# Altium schematic sheet Sheet2.SchDoc
size B
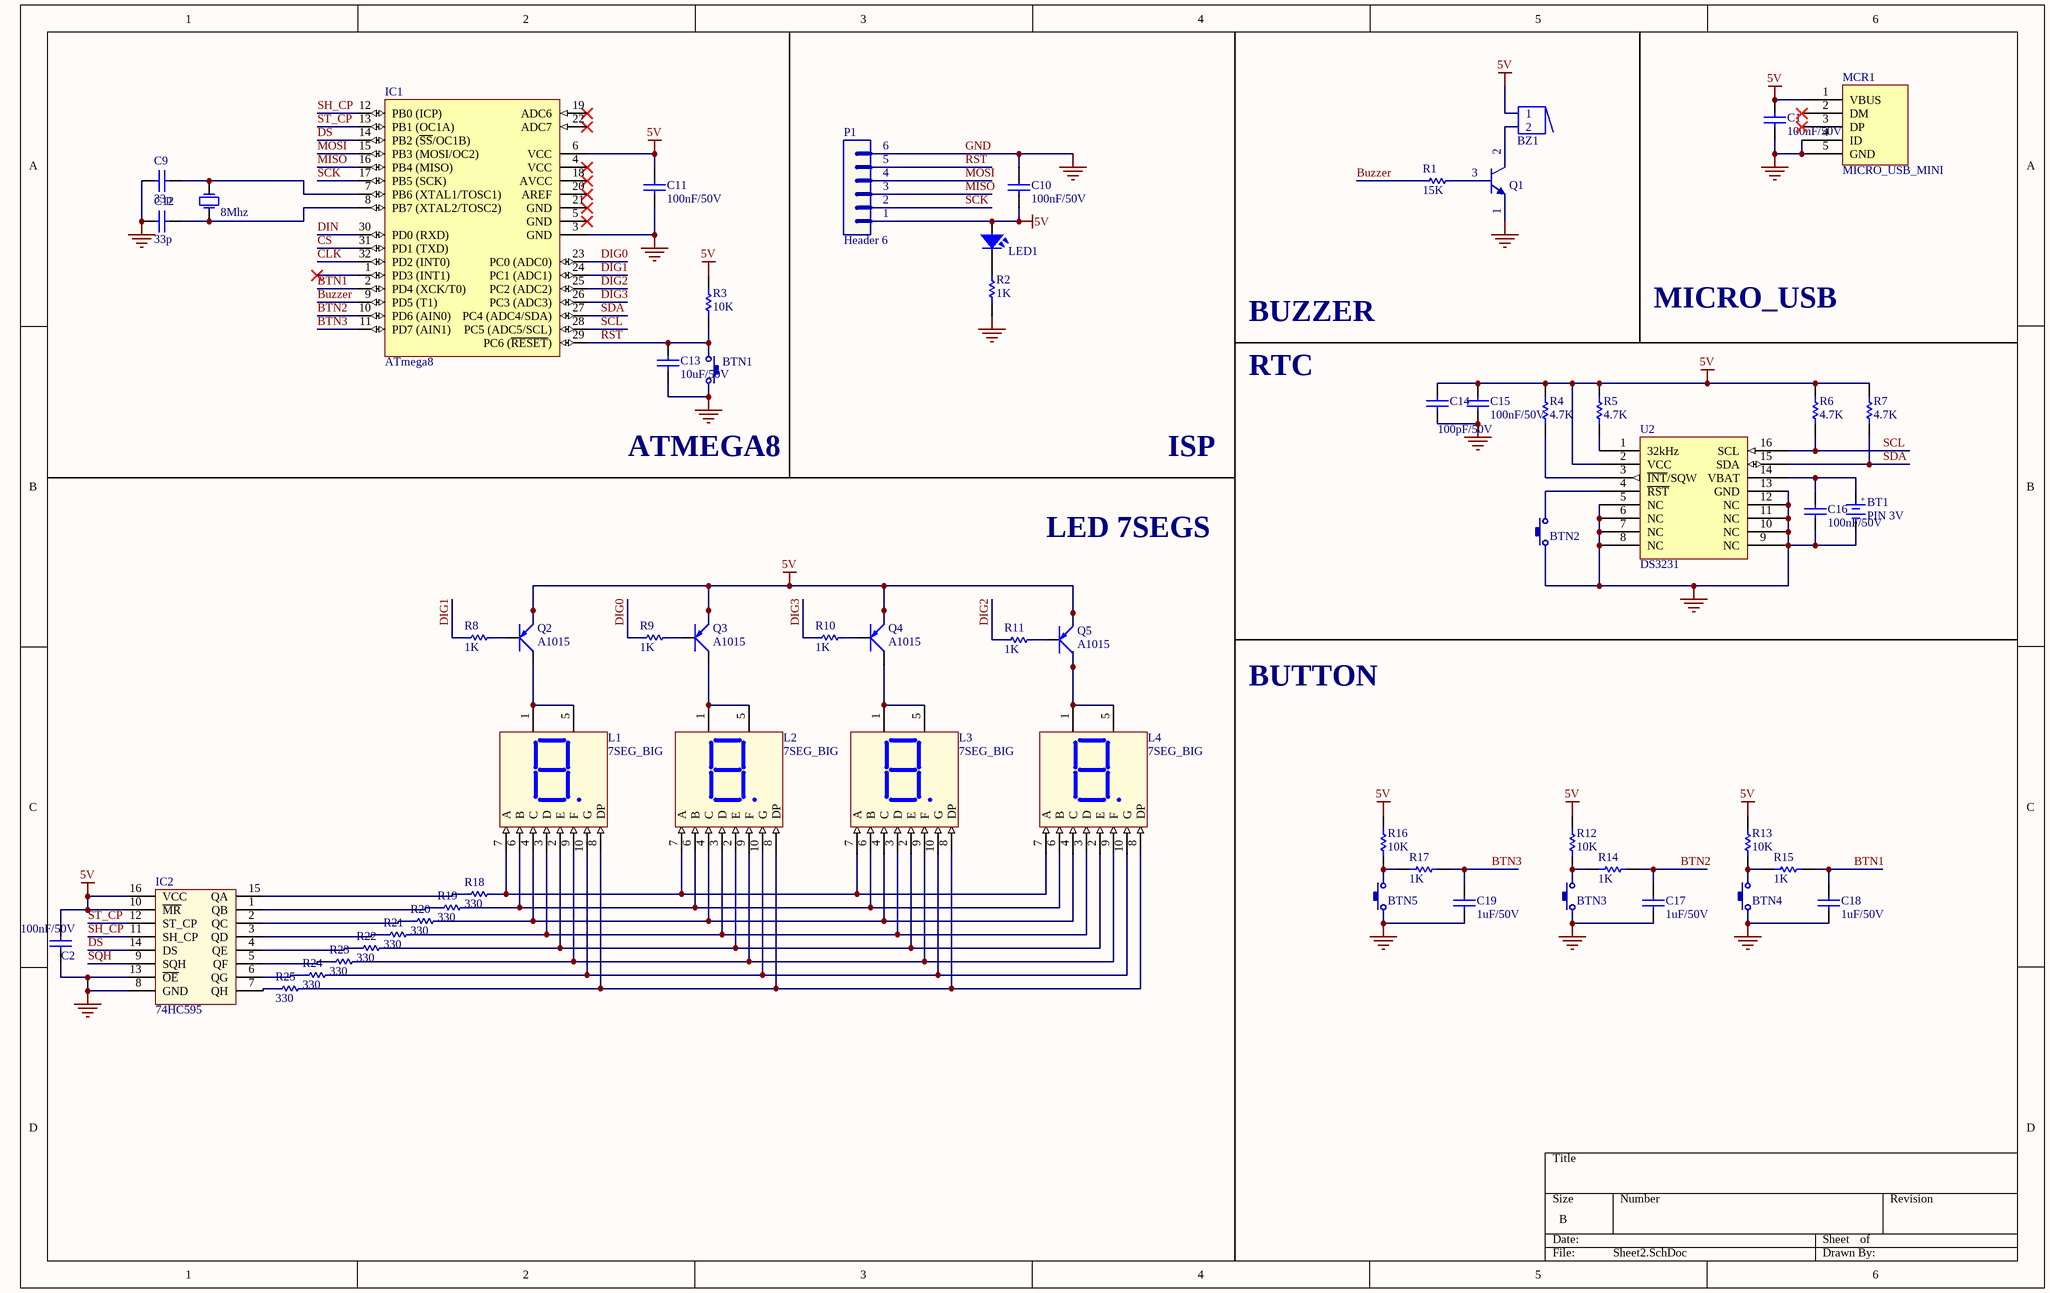
[diagram p0: Sheet2.SchDoc]

## Parts
BT1  PIN 3V  [PIN3V]
BTN1  Button  [Button]  (value not drawn)
BTN2  Button  [Button]  (value not drawn)
BTN3  Button  [Button]  (value not drawn)
BTN4  Button  [Button]  (value not drawn)
BTN5  Button  [Button]  (value not drawn)
BZ1  Buzzer  [BUZZER]  (value not drawn)
C1  value 100nF/50V  [CAP-SM-0805]  (hidden comment: Cap-100nF-50V-0805)
C2  value 100nF/50V  [CAP-SM-0805]  (hidden comment: Cap-100nF-50V-0805)
C9  value 33p  [Tu-pico]  (hidden comment: Capacitor Ceramic)
C10  value 100nF/50V  [CAP-SM-0805]  (hidden comment: Cap-100nF-50V-0805)
C11  value 100nF/50V  [CAP-SM-0805]  (hidden comment: Cap-100nF-50V-0805)
C12  value 33p  [Tu-pico]  (hidden comment: Capacitor Ceramic)
C13  value 10uF/50V  [CAP-SM-0805]  (hidden comment: Cap-10uF-50V-0805)
C14  value 100pF/50V  [CAP-SM-0805]  (hidden comment: Cap-100pF-50V-0805)
C15  value 100nF/50V  [CAP-SM-0805]  (hidden comment: Cap-10uF-50V-0805)
C16  value 100nF/50V  [CAP-SM-0805]  (hidden comment: Cap-10uF-50V-0805)
C17  value 1uF/50V  [CAP-SM-0805]  (hidden comment: Cap-10uF-50V-0805)
C18  value 1uF/50V  [CAP-SM-0805]  (hidden comment: Cap-10uF-50V-0805)
C19  value 1uF/50V  [CAP-SM-0805]  (hidden comment: Cap-10uF-50V-0805)
IC1  ATmega8  [32A_ATM]
IC2  74HC595  [DIP16/W0.3]
L1  7SEG_BIG  [7SEGS_BIG 48 x 70]
L2  7SEG_BIG  [7SEGS_BIG 48 x 70]
L3  7SEG_BIG  [7SEGS_BIG 48 x 70]
L4  7SEG_BIG  [7SEGS_BIG 48 x 70]
LED1  LED  [LED 3512]  (value not drawn)
MCR1  MICRO_USB_MINI  [USB-B-Mini]
P1  Header 6  [JP6]
Q1  Transistor C1815  [SOT23-3 Leads]  (value not drawn)
Q2  A1015  [SOT23B]
Q3  A1015  [SOT23B]
Q4  A1015  [SOT23B]
Q5  A1015  [SOT23B]
R1  value 15K  [RES-SM-0805]  (hidden comment: Resistor 1/4W)
R2  value 1K  [RES-SM-0805]  (hidden comment: Res-1K-0805)
R3  value 10K  [RES-SM-0805]  (hidden comment: Res-10k-0805)
R4  value 4.7K  [RES-SM-0805]  (hidden comment: Res-10k-0805)
R5  value 4.7K  [RES-SM-0805]  (hidden comment: Res-10k-0805)
R6  value 4.7K  [RES-SM-0805]  (hidden comment: Res-10k-0805)
R7  value 4.7K  [RES-SM-0805]  (hidden comment: Res-10k-0805)
R8  value 1K  [RES-SM-0805]  (hidden comment: Resistor 1/4W)
R9  value 1K  [RES-SM-0805]  (hidden comment: Resistor 1/4W)
R10  value 1K  [RES-SM-0805]  (hidden comment: Resistor 1/4W)
R11  value 1K  [RES-SM-0805]  (hidden comment: Resistor 1/4W)
R12  value 10K  [RES-SM-0805]  (hidden comment: Res-1K-0805)
R13  value 10K  [RES-SM-0805]  (hidden comment: Res-1K-0805)
R14  value 1K  [RES-SM-0805]  (hidden comment: Res-1K-0805)
R15  value 1K  [RES-SM-0805]  (hidden comment: Res-1K-0805)
R16  value 10K  [RES-SM-0805]  (hidden comment: Res-1K-0805)
R17  value 1K  [RES-SM-0805]  (hidden comment: Res-1K-0805)
R18  value 330  [RES-SM-0805]  (hidden comment: Resistor 1/4W)
R19  value 330  [RES-SM-0805]  (hidden comment: Resistor 1/4W)
R20  value 330  [RES-SM-0805]  (hidden comment: Resistor 1/4W)
R21  value 330  [RES-SM-0805]  (hidden comment: Resistor 1/4W)
R22  value 330  [RES-SM-0805]  (hidden comment: Resistor 1/4W)
R23  value 330  [RES-SM-0805]  (hidden comment: Resistor 1/4W)
R24  value 330  [RES-SM-0805]  (hidden comment: Resistor 1/4W)
R25  value 330  [RES-SM-0805]  (hidden comment: Resistor 1/4W)
U2  DS3231  [SL3016]
Y1  8Mhz  [XTAL]

## Nets
5V: BZ1.1 C1.2 C2.2 C10.1 C11.2 C14.2 C15.2 IC1.6(VCC) IC2.10(~{MR}) IC2.16(VCC) LED1.1 MCR1.1(VBUS) P1.1 Q2.1(E) Q3.1(E) Q4.1(E) Q5.1(E) R3.2 R4.2 R5.2 R6.2 R7.2 R12.2 R13.2 R16.2 U2.2(VCC)
GND: BT1.2(GND) BTN1.2 BTN2.1 BTN3.1 BTN4.1 BTN5.1 C1.1 C2.1 C9.1 C10.2 C11.1 C12.1 C13.1 C14.1 C15.1 C16.1 C17.2 C18.2 C19.2 IC1.3(GND) IC2.8(GND) IC2.13(~{OE}) MCR1.4(ID) MCR1.5(GND) P1.6 Q1.1(E) R2.1 U2.5(NC) U2.6(NC) U2.7(NC) U2.8(NC) U2.9(NC) U2.10(NC) U2.11(NC) U2.12(NC) U2.13(GND)
VCC: IC2.16(VCC)
BTN1: C18.1 IC1.2(PD4_(XCK/T0)) R15.2
BTN2: C17.1 IC1.10(PD6_(AIN0)) R14.2
BTN3: C19.1 IC1.11(PD7_(AIN1)) R17.2
Buzzer: IC1.9(PD5_(T1)) R1.1
CLK: IC1.32(PD2_(INT0))
CS: IC1.31(PD1_(TXD))
DIG0: IC1.23(PC0_(ADC0)) R9.1
DIG1: IC1.24(PC1_(ADC1)) R8.1
DIG2: IC1.25(PC2_(ADC2)) R11.1
DIG3: IC1.26(PC3_(ADC3)) R10.1
DIN: IC1.30(PD0_(RXD))
DS: IC1.14(PB2_(~{SS}/OC1B)) IC2.14(DS)
MISO: IC1.16(PB4_(MISO)) P1.3
MOSI: IC1.15(PB3_(MOSI/OC2)) P1.4
RST: BTN1.1 C13.2 IC1.29(PC6_(~{RESET})) P1.5 R3.1
SCK: IC1.17(PB5_(SCK)) P1.2
SCL: IC1.28(PC5_(ADC5/SCL)) R6.1 U2.16(SCL)
SDA: IC1.27(PC4_(ADC4/SDA)) R7.1 U2.15(SDA)
SH_CP: IC1.12(PB0_(ICP)) IC2.11(SH_CP)
SQH: IC2.9(SQH)
ST_CP: IC1.13(PB1_(OC1A)) IC2.12(ST_CP)
NetBT1_1: BT1.1(+3V) C16.2 U2.14(VBAT)
NetBTN2_2: BTN2.2 U2.4(~{RST})
NetBTN3_2: BTN3.2 R12.1 R14.1
NetBTN4_2: BTN4.2 R13.1 R15.1
NetBTN5_2: BTN5.2 R16.1 R17.1
NetBZ1_2: BZ1.2 Q1.2(C)
NetC9_2: C9.2 IC1.7(PB6_(XTAL1/TOSC1)) Y1.2(OSC2)
NetC12_2: C12.2 IC1.8(PB7_(XTAL2/TOSC2)) Y1.1(OSC1)
NetIC2_1: IC2.1(QB) R19.1
NetIC2_2: IC2.2(QC) R20.1
NetIC2_3: IC2.3(QD) R21.1
NetIC2_4: IC2.4(QE) R22.1
NetIC2_5: IC2.5(QF) R23.1
NetIC2_6: IC2.6(QG) R24.1
NetIC2_7: IC2.7(QH) R25.1
NetIC2_15: IC2.15(QA) R18.1
NetL1_1: L1.1(AC) L1.5(AC) Q2.2(C)
NetL1_2: L1.2(E) L2.2(E) L3.2(E) L4.2(E) R22.2
NetL1_3: L1.3(D) L2.3(D) L3.3(D) L4.3(D) R21.2
NetL1_4: L1.4(C) L2.4(C) L3.4(C) L4.4(C) R20.2
NetL1_6: L1.6(B) L2.6(B) L3.6(B) L4.6(B) R19.2
NetL1_7: L1.7(A) L2.7(A) L3.7(A) L4.7(A) R18.2
NetL1_8: L1.8(DP) L2.8(DP) L3.8(DP) L4.8(DP) R25.2
NetL1_9: L1.9(F) L2.9(F) L3.9(F) L4.9(F) R23.2
NetL1_10: L1.10(G) L2.10(G) L3.10(G) L4.10(G) R24.2
NetL2_1: L2.1(AC) L2.5(AC) Q3.2(C)
NetL3_1: L3.1(AC) L3.5(AC) Q4.2(C)
NetL4_1: L4.1(AC) L4.5(AC) Q5.2(C)
NetLED1_2: LED1.2 R2.2
NetQ1_3: Q1.3(B) R1.2
NetQ2_3: Q2.3(B) R8.2
NetQ3_3: Q3.3(B) R9.2
NetQ4_3: Q4.3(B) R10.2
NetQ5_3: Q5.3(B) R11.2
NetR4_1: R4.1 U2.3(~{INT}/SQW)
NetR5_1: R5.1 U2.1(32kHz)

Not connected (* = marked no-connect by the designer): IC1 1(PD3_(INT1))* 4(VCC)* 5(GND)* 18(AVCC)* 19(ADC6)* 20(AREF)* 21(GND)* 22(ADC7)*; MCR1 2(DM)* 3(DP)*

## Notes on the sheet
- BUZZER
- MICRO_USB
- RTC
- ATMEGA8
- ISP
- LED 7SEGS
- BUTTON
- (in symbol PIN 3V) +; -

## Library data of the parts
BT1 = PIN 3V: Battery 3VDC; Value: PIN 3V
C1 C2 C10 C11 = Cap-100nF-50V-0805: CAP CER 0.1UF 50V Y5V 0805; Manufacturer: Samsung Electro-Mechanics; Manufacturer Part Number: CL21F104ZBCNNNC; Local Supplier: thegioiic; Local Supplier Link: https://thegioiic.com/products/tu-100nf-0-1uf-50v-0805; Supplier 1: Digikey; Supplier 1 Part Number: 1276-1007-1-ND; Supplier 1 Link: https://www.digikey.com/product-detail/en/samsung-electro-mechanics/CL21F104ZBCNNNC/1276-1007-1-ND/3889093
C9 C12 = CapCeramic: Capacitor; Published: 8-Jun-2000; LatestRevisionDate: 17-Jul-2002; LatestRevisionNote: Re-released for DXP Platform.; PackageReference: RAD-0.3; Publisher: Altium Limited
C13 C15-C19 = Cap-10uF-50V-0805: CAP CER 10UF 50V X5R 0805; Manufacturer: Yageo; Manufacturer Part Number: CC0805KKX5R9BB106; Local Supplier: thegioiic; Local Supplier Link: https://thegioiic.com/products/tu-10uf-50v-0805; Supplier 1: Digikey; Supplier 1 Link: https://www.digikey.com/product-detail/en/yageo/CC0805KKX5R9BB106/311-3499-2-ND/7164383; Supplier 1 Part Number: 311-3499-2-ND
C14 = Cap-100pF-50V-0805: CAP CER 100PF 50V C0G/NP0 0805; Manufacturer: KEMET; Manufacturer Part Number: C0805C101J5GACTU; Local Supplier: thegioiic; Local Supplier Link: https://thegioiic.com/products/tu-100pf-50v-0805; Supplier 1: Digikey; Supplier 1 Part Number: 399-1122-1-ND; Supplier 1 Link: https://www.digikey.com/product-detail/en/kemet/C0805C101J5GACTU/399-1122-1-ND/411397
IC1 = ATmega8A-AU: 8-Bit AVR Microcontroller with 8K Bytes of In-System Programmable Flash Memory; Value: ATmega8-L
IC2 = 74595: 8 Bit Serial input - Parallel Output; Value: 74HC595
LED1 = LED SMD: Value: LED 3 - 5 ly 2 Colour
P1 = Header 6: Header, 6-Pin; LatestRevisionDate: 17-Jul-2002; LatestRevisionNote: Re-released for DXP Platform.; Publisher: Altium Limited
Q1 = C1815
Q2-Q5 = A1015: PNP 600mW, ECB; Value: A1015
R1 R8-R11 R18-R25 = RES
R2 R12-R17 = Res-1K-0805: RES 1K OHM 1% 1/4W 0805; Manufacturer: Stackpole Electronics Inc; Manufacturer Part Number: RNCP0805FTD1K00; Local Supplier: thegioiic; Local Supplier Link: https://thegioiic.com/products/dien-tro-1k-ohm-0805-5; Supplier 1: Digikey; Supplier 1 Link: https://www.digikey.com/product-detail/en/stackpole-electronics-inc/RNCP0805FTD1K00/RNCP0805FTD1K00CT-ND/2240568; Supplier 1 Part Number: RNCP0805FTD1K00CT-ND
R3-R7 = Res-10k-0805: RES 10K OHM 1% 1/4W 0805; Manufacturer: Stackpole Electronics Inc; Manufacturer Part Number: RNCP0805FTD10K0; Local Supplier: thegioiic; Local Supplier Link: https://thegioiic.com/products/dien-tro-10k-ohm-0805-5; Supplier 1: Digikey; Supplier 1 Link: https://www.digikey.com/product-detail/en/stackpole-electronics-inc/RNCP0805FTD10K0/RNCP0805FTD10K0CT-ND/2240601; Supplier 1 Part Number: RNCP0805FTD10K0CT-ND
Y1 = XTAL: Crystal Oscillator; Published: 8-Jun-2000; LatestRevisionDate: 17-Jul-2002; LatestRevisionNote: Re-released for DXP Platform.; PackageReference: R38; Publisher: Altium Limited